# Altium schematic sheet LogiTemp.SchDoc
size A4; SheetNumber: 1; SheetTotal: 1
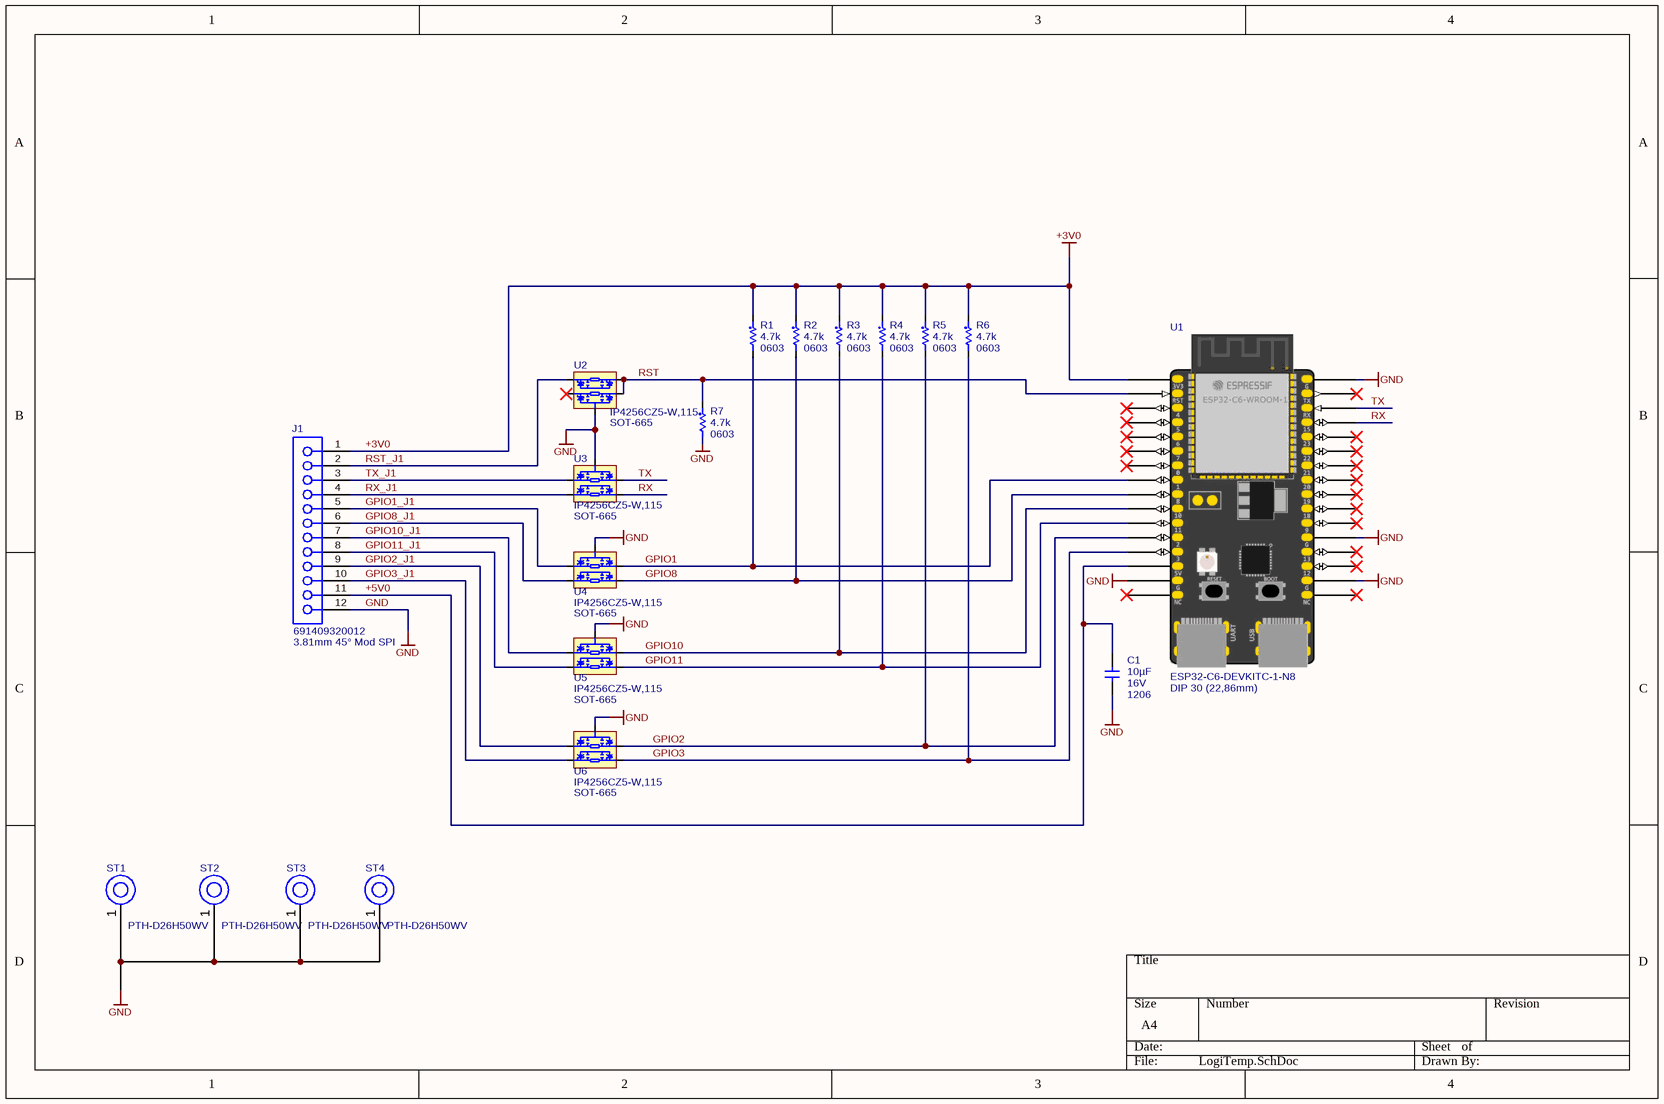
[diagram p0: LogiTemp.SchDoc]

## Parts
C1  value 10µF  Voltage Rating: 16V  Case/Package: 1206  [C1206_IPC_B_3.2x1.6x1.60mm]  (hidden comment: CAP CER 10µF 16V ±10% X7R 1206)
J1  691409320012  Case/Package: 3.81mm 45° Mod SPI  [691409320012]
R1  value 4.7k  Case/Package: 0603  [R0603_IPC_B_1.55x0.8x0.55mm]  (hidden comment: RES SMD 4.7k 1% 1/4W 0603)
R2  value 4.7k  Case/Package: 0603  [R0603_IPC_B_1.55x0.8x0.55mm]  (hidden comment: RES SMD 4.7k 1% 1/4W 0603)
R3  value 4.7k  Case/Package: 0603  [R0603_IPC_B_1.55x0.8x0.55mm]  (hidden comment: RES SMD 4.7k 1% 1/4W 0603)
R4  value 4.7k  Case/Package: 0603  [R0603_IPC_B_1.55x0.8x0.55mm]  (hidden comment: RES SMD 4.7k 1% 1/4W 0603)
R5  value 4.7k  Case/Package: 0603  [R0603_IPC_B_1.55x0.8x0.55mm]  (hidden comment: RES SMD 4.7k 1% 1/4W 0603)
R6  value 4.7k  Case/Package: 0603  [R0603_IPC_B_1.55x0.8x0.55mm]  (hidden comment: RES SMD 4.7k 1% 1/4W 0603)
R7  value 4.7k  Case/Package: 0603  [R0603_IPC_B_1.55x0.8x0.55mm]  (hidden comment: RES SMD 4.7k 1% 1/4W 0603)
ST1  PTH-D26H50WV  [PTH-D26H50WV]
ST2  PTH-D26H50WV  [PTH-D26H50WV]
ST3  PTH-D26H50WV  [PTH-D26H50WV]
ST4  PTH-D26H50WV  [PTH-D26H50WV]
U1  ESP32-C6-DEVKITC-1-N8  Case/Package: DIP 30 (22,86mm)  [ESP32-C6-DEVKITC-1-N8]
U2  IP4256CZ5-W,115  Case/Package: SOT-665  [SOT665_NXP]
U3  IP4256CZ5-W,115  Case/Package: SOT-665  [SOT665_NXP]
U4  IP4256CZ5-W,115  Case/Package: SOT-665  [SOT665_NXP]
U5  IP4256CZ5-W,115  Case/Package: SOT-665  [SOT665_NXP]
U6  IP4256CZ5-W,115  Case/Package: SOT-665  [SOT665_NXP]

## Nets
+3V0: J1.1 R1.1 R2.1 R3.1 R4.1 R5.1 R6.1 U1.1(3V3)
GND: C1.2 J1.12 R7.2 ST1.1(H1) ST2.1(H1) ST3.1(H1) ST4.1(H1) U1.15(GND) U1.18(GND) U1.21(GND) U1.32(GND) U2.2(PAD) U3.2(PAD) U4.2(PAD) U5.2(PAD) U6.2(PAD)
+5V0: C1.1 J1.11 U1.14(5V0)
GPIO1: R1.2 U1.8(1/N) U4.5
GPIO1_J1: J1.5 U4.1
GPIO2: R5.2 U1.12 U6.5
GPIO2_J1: J1.9 U6.1
GPIO3: R6.2 U1.13(GND) U6.4
GPIO3_J1: J1.10 U6.3
GPIO8: R2.2 U1.9 U4.4
GPIO8_J1: J1.6 U4.3
GPIO10: R3.2 U1.10 U5.5
GPIO10_J1: J1.7 U5.1
GPIO11: R4.2 U1.11 U5.4
GPIO11_J1: J1.8 U5.3
RST: R7.1 U1.2(RST) U2.4 U2.5
RST_J1: J1.2 U2.3
RX: U1.29 U3.4
RX_J1: J1.4 U3.3
TX: U1.30(RX) U3.5
TX_J1: J1.3 U3.1

Not connected (* = marked no-connect by the designer): U1 3(2)* 4(3)* 5(4)* 6(5)* 7(0/N)* 16(NC)* 17(NC)* 19(12)* 20(13)* 22(9)* 23(18)* 24(19)* 25(20)* 26(21)* 27(22)* 28(23)* 31(TX)*; U2 1*

## Library data of the parts
C1 = CMP-001-00315-3: Capacitor Type: Ceramic; Min Operating Temperature: -55°C; Pins: 2; Ceramic Type: X7R; Tolerance: 10%; Mounting Technology: Surface Mount; RoHS Compliant: Yes; Max Operating Temperature: 125°C
J1 = CMP-002-00694-1: Terminal Block, Wtb, 12POS, 26-16AWG;; Gender: Female; Connector Type: WR-TBL Screwless Push In; Pins: 12; RoHS Compliant: Yes; Min Operating Temperature: -40°C; Mounting Technology: Through Hole; Max Operating Temperature: 115°C
R1-R7 = CMP-009-00204-3: Power: 250mW; Voltage Rating: 75V; Mounting Technology: Surface Mount; Min Operating Temperature: -55°C; Tolerance: 1%; Max Operating Temperature: 155°C; Pins: 2; Case Code (Metric): 1608; Case Code (Imperial): 0603; RoHS Compliant: Yes
ST1-ST4 = CMP-00028-00046-1: RoHS Compliant: Yes; Case/Package: PTH-D26H50WV; Max Operating Temperature: 155°C; Pins: 1; Mounting Technology: Through hole; Min Operating Temperature: -55°C
U1 = CMP-020-00032-3: ESP32-C6 General-purpose Develop; Min Supply Voltage: 5V; RAM Size: 4M; I/Os: 21; Interface: USB; Power: 2.64W; Pins: 32; Mounting Technology: Through Hole; RoHS Compliant: Yes; Max Supply Voltage: 5V
U2-U6 = CMP-032-00000-5: NXP IP4256CZ5-W, Dual Uni-Directional EMI Filter & ESD Protector, 120mW, 5-Pin SOT-665; Max Reverse Leakage Current: 100nA; Test Current: 1mA; Direction: Unidirectional; ESD Protection: Yes; Min Breakdown Voltage: 5.8V; RoHS Compliant: Yes; Mount: Surface Mount; Peak Pulse Power: 120mW; Length: 1.7mm; Min Operating Temperature: -40°C; Max Operating Temperature: 85°C; Height: 0.6mm; Mounting Technology: Surface Mount; Number of Pins: 5; Pins: 5; Width: 1.3mm